# Altium project PSU5V8A.PrjPcb
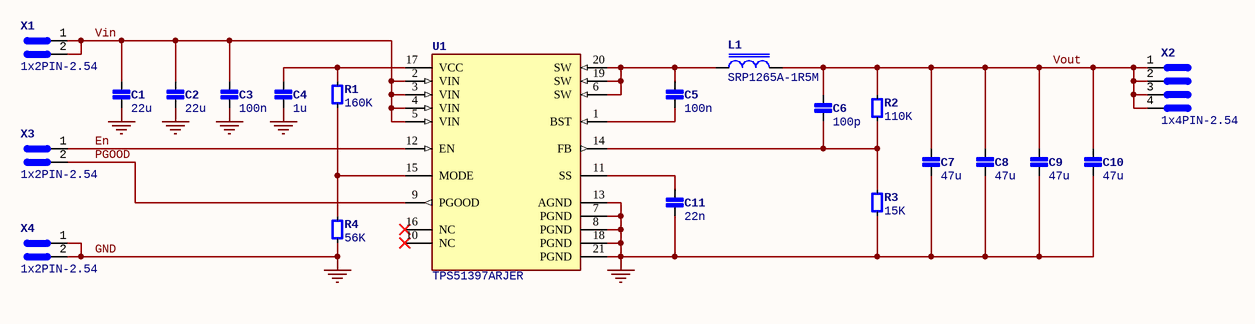
[diagram p0: PSU5V8A.SchDoc]
1 sheet, 21 parts. Net scope: global (net labels, ports and power ports of the same name join across sheets).
Board file: PSU5V8A.PcbDoc

## Sheet PSU5V8A.SchDoc: 5V, 8A DC-DC Power Supply
size A4; Date: 2023/10/30; DocumentNumber: DCATX-PSU01-001; SheetNumber: 1; SheetTotal: 1

### Parts
C1  22u  [CAPC1206N]
C2  22u  [CAPC1206N]
C3  100n  [CAPC0603N]
C4  1u  [CAPC0603N]
C5  100n  [CAPC0603N]
C6  100p  [CAPC0603N]
C7  47u  [CAPC1206N]
C8  47u  [CAPC1206N]
C9  47u  [CAPC1206N]
C10  47u  [CAPC1206N]
C11  22n  [CAPC0603N]
L1  SRP1265A-1R5M  [AXIAL0.4]
R1  160K  [RESC0603N]
R2  110K  [RESC0603N]
R3  15K  [RESC0603N]
R4  56K  [RESC0603N]
U1  TPS51397ARJER  [FP-RJE0020B-MFG]
X1  1x2PIN-2.54  [HDR1X2-P2.54]
X2  1x4PIN-2.54  [HDR1X4-P2.54]
X3  1x2PIN-2.54  [HDR1X2-P2.54]
X4  1x2PIN-2.54  [HDR1X2-P2.54]

### Nets
GND: C1.2 C2.2 C3.2 C4.2 C7.2 C8.2 C9.2 C10.2 C11.2 R3.2 R4.1 U1.7(PGND) U1.8(PGND) U1.13(AGND) U1.18(PGND) U1.21(PGND) X4.1 X4.2
En: U1.12(EN) X3.1
PGOOD: U1.9(PGOOD) X3.2
Vin: C1.1 C2.1 C3.1 U1.2(VIN) U1.3(VIN) U1.4(VIN) U1.5(VIN) X1.1 X1.2
Vout: C6.1 C7.1 C8.1 C9.1 C10.1 L1.2 R2.1 X2.1 X2.2 X2.3 X2.4
NetC4_1: C4.1 R1.2 U1.17(VCC)
NetC5_1: C5.1 L1.1 U1.6(SW) U1.19(SW) U1.20(SW)
NetC5_2: C5.2 U1.1(BST)
NetC6_2: C6.2 R2.2 R3.1 U1.14(FB)
NetC11_1: C11.1 U1.11(SS)
NetR1_1: R1.1 R4.2 U1.15(MODE)

Not connected (* = marked no-connect by the designer): U1 10(NC)* 16(NC)*

### Library data of the parts
C1 C2 = CAPACITOR(S): 名称: 贴片MLCC电容; 代号: C; 型号: 1206-35V-20%; 备注: TDK X5R系列
C3-C5 C11 = CAPACITOR(S): 名称: 贴片MLCC电容; 代号: C; 型号: 0603-25V-5%; 备注: TDK X7R系列
C6 = CAPACITOR(S): 名称: 贴片MLCC电容; 代号: C; 型号: 0603-10V-5%; 备注: Kemet C0G/NP0系列
C7-C10 = CAPACITOR(S): 名称: 贴片MLCC电容; 代号: C; 型号: 1206-10V-20%; 备注: TDK X5R 系列
L1 = IND: 代号: L; 名称: 贴片功率电感; 备注: Bourns SRP1265A 系列; 型号: SRP1265A-1R5M
R1-R4 = RESISTOR(S): 电阻; 代号: R; 名称: 贴片电阻; 型号: RESC-0603-1%
U1 = CMP-04918-000702-1: 10-A SYNCHRONOUS STEP-DOWN REGUL; 代号: U; 名称: 贴片集成电路
X1 X3 X4 = 2PIN-PCB-Connector: 线路板接插件; 代号: X; 名称: 接插件; 型号: 2.54通孔排针
X2 = 4PIN-PCB-Connector: 线路板接插件; 代号: X; 名称: 接插件; 型号: 2.54通孔排针